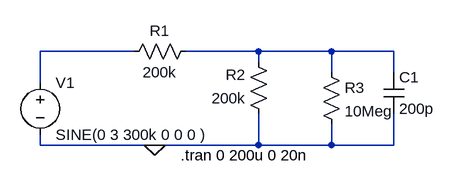
[diagram p0: schematic Exp2part8.asc]
Exp2part8.asc, the LTspice schematic file:
Version 4
SHEET 1 880 680
WIRE 48 -16 -96 -16
WIRE 240 -16 128 -16
WIRE 352 -16 240 -16
WIRE 448 -16 352 -16
WIRE 240 0 240 -16
WIRE 352 16 352 -16
WIRE 448 16 448 -16
WIRE -96 32 -96 -16
WIRE -96 128 -96 112
WIRE 80 128 -96 128
WIRE 240 128 240 80
WIRE 240 128 80 128
WIRE 352 128 352 96
WIRE 352 128 240 128
WIRE 448 128 448 80
WIRE 448 128 352 128
FLAG 80 128 0
SYMBOL voltage -96 16 R0
WINDOW 123 0 0 Left 0
WINDOW 39 0 0 Left 0
SYMATTR InstName V1
SYMATTR Value SINE(0 3 300k 0 0 0 )
SYMBOL res 144 -32 R90
WINDOW 0 0 56 VBottom 2
WINDOW 3 32 56 VTop 2
SYMATTR InstName R1
SYMATTR Value 200k
SYMBOL res 256 96 R180
WINDOW 0 36 76 Left 2
WINDOW 3 36 40 Left 2
SYMATTR InstName R2
SYMATTR Value 200k
SYMBOL res 336 0 R0
SYMATTR InstName R3
SYMATTR Value 10Meg
SYMBOL cap 432 16 R0
SYMATTR InstName C1
SYMATTR Value 200p
TEXT 120 144 Left 2 !.tran 0 200u 0 20n

The netlist it stands for:
* Exp2part8.asc
V1 N001 0 SINE(0 3 300k 0 0 0 )
R1 N002 N001 200k
R2 0 N002 200k
R3 N002 0 10Meg
C1 N002 0 200p
.tran 0 200u 0 20n
.backanno
.end